# EasyEDA Pro project MecanumDrone_SchematicV1.epro

# Schematic Schematic1
Board Name: Board1; Create Date: 2026-01-27; Page Name: P1; Project Name: Mecanum_Drone_PCB; Schematic Name: Schematic1; Update Date: 2026-01-27; Company: EasyEDA.com; Page Size: A4; Version: V1.0
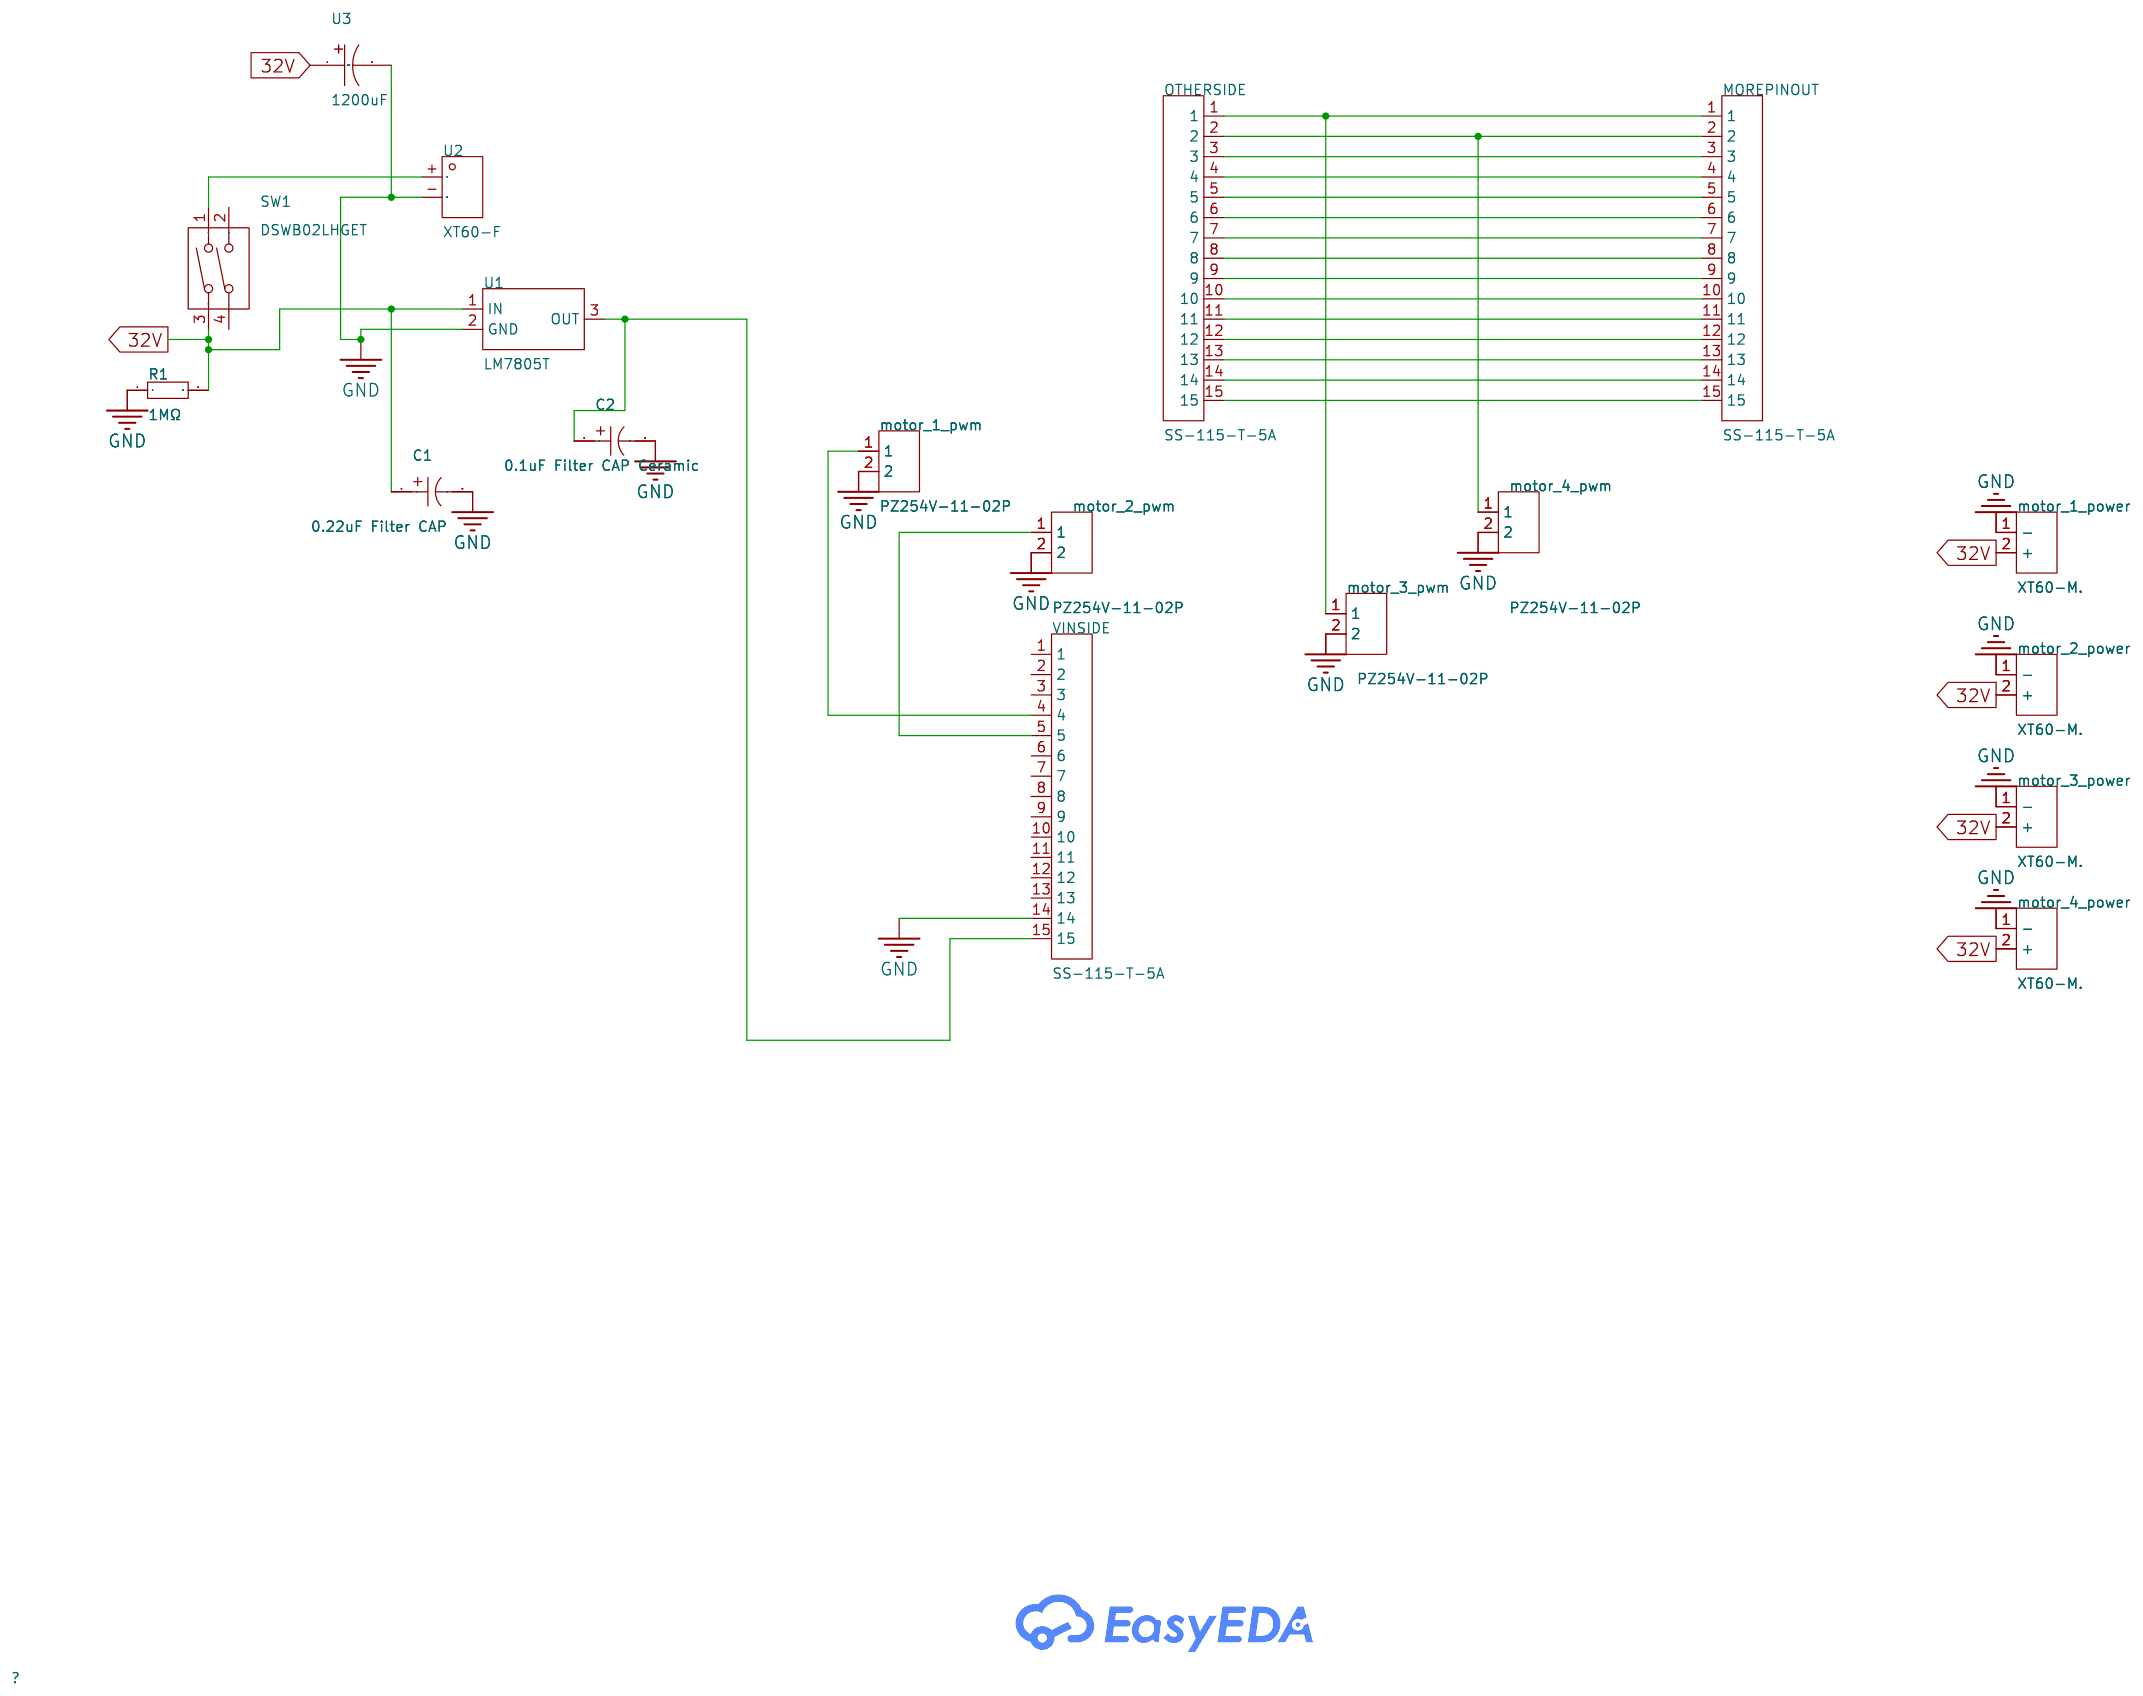
[diagram p0: schematic sheet]

## Parts
C1  0.22uF Filter CAP  [CAP-TH_BD6.0-P2.50-D0.5-FD]
C2  0.1uF Filter CAP Ceramic  [CAP-TH_BD6.0-P2.50-D0.5-FD]
MOREPINOUT  SS-115-T-5A  [HDR-TH_15P-SS-115-T-5A]
motor_1_power  XT60-M.  [CONN-TH_XT60]
motor_1_pwm  PZ254V-11-02P  [HDR-TH_2P-P2.54-V-M]
motor_2_power  XT60-M.  [CONN-TH_XT60]
motor_2_pwm  PZ254V-11-02P  [HDR-TH_2P-P2.54-V-M]
motor_3_power  XT60-M.  [CONN-TH_XT60]
motor_3_pwm  PZ254V-11-02P  [HDR-TH_2P-P2.54-V-M]
motor_4_power  XT60-M.  [CONN-TH_XT60]
motor_4_pwm  PZ254V-11-02P  [HDR-TH_2P-P2.54-V-M]
OTHERSIDE  SS-115-T-5A  [HDR-TH_15P-SS-115-T-5A]
R1  1MΩ  [RES-TH_BD2.2-L6.5-P10.50-D0.6]
SW1  DSWB02LHGET  [SW-TH_DSWB02LHGET]
U1  LM7805T  [TO-220-3_L10.0-W4.5-P2.54-L-1]
U2  XT60-F  [CONN-TH_XT60PB-F]
U3  1200uF  [CAP-TH_BD30.0-P10.00-D2.3-FD]
VINSIDE  SS-115-T-5A  [HDR-TH_15P-SS-115-T-5A]

## Library data of the parts
C1 C2 = KM1E101M0611: Capacitance:100uF Tolerance:±20% Tolerance:±20% Voltage Rating:25V Ripple Current:142mA@120kHz Equivalent Series Resistance(ESR):- Pin Spacing:2.5mm Diameter:- Height - Seated (Max):- Lifetime:2000hrs@105℃ Operating Temperature:-40℃~+105℃ Operating Temper; LCSC Part Name: 100uF ±20% 25V; Supplier Part: C2873969; Manufacturer: ROQANG(容强); Supplier Footprint: 插件; JLCPCB Part Class: Extended Part; Datasheet: https://item.szlcsc.com/datasheet/KM1E101M0611/3078452.html; Supplier: LCSC; Tolerance: ±20%; Voltage Rating: 25V; Ripple Current: 142mA@120kHz; Pin Spacing: 2.5mm; Lifetime: 2000hrs@105℃; Operating Temperature: -40℃~+105℃
MOREPINOUT OTHERSIDE VINSIDE = SS-115-T-5A: Pitch:2.54mm Mounting Type:Through Hole Number of Rows:1 Number of Positions:15P Insulation Height:2.54mm Contact Plating:Tin Operating Temperature:-55℃~+125℃ Operating Temperature:-55℃~+125℃; LCSC Part Name: 间距:2.54mm 直插; Supplier Part: C7369866; Manufacturer: SAMTEC; Supplier Footprint: 插件,P=2.54mm; JLCPCB Part Class: Extended Part; Datasheet: https://item.szlcsc.com/datasheet/SS-115-T-5A/8340830.html; Supplier: LCSC; Pitch: 2.54mm; Mounting Type: Through Hole; Number of Rows: 1; Number of Positions: 15P; Insulation Height: 2.54mm; Contact Plating: Tin; Operating Temperature: -55℃~+125℃
motor_1_power motor_2_power motor_3_power motor_4_power = XT60-M.: LCSC Part Name: AMASS(艾迈斯) XT60模型插头 3.5mm镀金香蕉头公头（电调端）XT60-M; Supplier Part: C98733; Manufacturer: AMASS(艾迈斯); JLCPCB Part Class: Extended Part; Datasheet: https://item.szlcsc.com/datasheet/XT60-M./99943.html; Supplier: LCSC
motor_1_pwm motor_2_pwm motor_3_pwm motor_4_pwm = PZ254V-11-02P: Pin Structure:1x2P Pitch:2.54mm Row Spacing:- Circluar Pins/Square Pins:Pin Header Mounting Type:Through Hole Number of Rows:1 Number of Pins:2P Current Rating:- Voltage Rating (Max):- Length of Mating Pin:6mm Insulation Height:2.5mm Length of End Connect; LCSC Part Name: 1x2P 间距:2.54mm 方针 直插; Supplier Part: C492401; Manufacturer: XFCN(兴飞); Supplier Footprint: 插件,P=2.54mm; JLCPCB Part Class: Extended Part; Datasheet: https://item.szlcsc.com/datasheet/PZ254V-11-02P/502957.html; Supplier: LCSC; Pin Structure: 1x2P; Pitch: 2.54mm; Circluar Pins/Square Pins: Pin Header; Mounting Type: Through Hole; Number of Rows: 1; Number of Pins: 2P; Length of Mating Pin: 6mm; Insulation Height: 2.5mm; Length of End Connection Pin: 3mm; Contact Material: Brass; Operating Temperature: -40℃~+105℃; Color: Black
R1 = RN1/2WS1MΩFT/BA1: Type:Metal Film Resistor Resistance:1MΩ Tolerance:±1% Tolerance:±1% Power(Watts):500mW Temperature Coefficient:±100ppm/℃ Temperature Coefficient:±100ppm/℃; LCSC Part Name: 1MΩ ±1% 500mW 金属膜电阻; Supplier Part: C385464; Manufacturer: Tyohm(幸亚电阻); Supplier Footprint: 插件,D2.4xL6.5mm; JLCPCB Part Class: Extended Part; Datasheet: https://item.szlcsc.com/datasheet/RN1%252F2WS1M%25CE%25A9FT%252FBA1/359311.html; Supplier: LCSC; Type: Metal Film Resistor; Tolerance: ±1%; Power(Watts): 500mW; Temperature Coefficient: ±100ppm/℃
SW1 = DSWB02LHGET: Type:Slide, Rocked Circuit:SPST Number of Positions:2 Lead Pitch:2.54mm Operating Life:- Color:Red; LCSC Part Name: 拨码开关,平拨开关,DSWB02LHGET; Supplier Part: C99421; Manufacturer: YE; Supplier Footprint: 插件,P=2.54mm; JLCPCB Part Class: Extended Part; Datasheet: https://item.szlcsc.com/datasheet/DSWB02LHGET/100635.html; Supplier: LCSC; Type: Slide, Rocked; Circuit: SPST; Number of Positions: 2; Lead Pitch: 2.54mm; Color: Red
U1 = LM7805T_C36350857: Output Type:Fixed Voltage - Supply:35V Output Voltage:5V Output Voltage:5V Output Current:1.5A Power Supply Rejection Ratio (PSRR):- Voltage Dropout:2V@(1.0A) Noise:- Operating Temperature:-40℃~+125℃ Operating Temperature:-40℃~+125℃ Output Configuration:P; LCSC Part Name: 5V 1.5A 35V; Supplier Part: C36350857; Manufacturer: HTC; Supplier Footprint: TO-220-3L; JLCPCB Part Class: Extended Part; Datasheet: https://item.szlcsc.com/datasheet/LM7805T/38073495.html; Supplier: LCSC; Output Type: Fixed; Voltage - Supply: 35V; Output Voltage: 5V; Output Current: 1.5A; Voltage Dropout: 2V@(1.0A); Operating Temperature: -40℃~+125℃; Output Configuration: Positive; Number of Outputs: 1
U2 = XT60-F: LCSC Part Name: AMASS(艾迈斯)XT60模型插头 3.5mm镀金香蕉头母头 XT60-F; Supplier Part: C98734; Manufacturer: AMASS(艾迈斯); JLCPCB Part Class: Extended Part; Datasheet: https://item.szlcsc.com/datasheet/XT60-F/99944.html; Supplier: LCSC
U3 = B43305B2128M67: Capacitance: Tolerance:±20% Tolerance:±20% Rated Voltage:; LCSC Part Name: 1200uF ±20% 200V; Supplier Part: C1647575; Manufacturer: TDK; Supplier Footprint: 插件; JLCPCB Part Class: Extended Part; Datasheet: https://atta.szlcsc.com/upload/public/pdf/source/20210702/9B2BA3B8BD2BC0A8ED472DCAE1779BDC.pdf; Supplier: LCSC; Tolerance: ±20%

## Nets
32V: C1.1 motor_1_power.2(+) motor_2_power.2(+) motor_3_power.2(+) motor_4_power.2(+) R1.2 SW1.3 U1.1(IN) U3.1
GND: C1.2 C2.2 motor_1_power.1(-) motor_1_pwm.2 motor_2_power.1(-) motor_2_pwm.2 motor_3_power.1(-) motor_3_pwm.2 motor_4_power.1(-) motor_4_pwm.2 R1.1 U1.2(GND) U2.-(2) U3.2 VINSIDE.14
Net-(C2-1): C2.1 U1.3(OUT) VINSIDE.15
Net-(MOREPINOUT-1): MOREPINOUT.1 motor_3_pwm.1 OTHERSIDE.1
Net-(MOREPINOUT-2): MOREPINOUT.2 motor_4_pwm.1 OTHERSIDE.2
Net-(MOREPINOUT-3): MOREPINOUT.3 OTHERSIDE.3
Net-(MOREPINOUT-4): MOREPINOUT.4 OTHERSIDE.4
Net-(MOREPINOUT-5): MOREPINOUT.5 OTHERSIDE.5
Net-(MOREPINOUT-6): MOREPINOUT.6 OTHERSIDE.6
Net-(MOREPINOUT-7): MOREPINOUT.7 OTHERSIDE.7
Net-(MOREPINOUT-8): MOREPINOUT.8 OTHERSIDE.8
Net-(MOREPINOUT-9): MOREPINOUT.9 OTHERSIDE.9
Net-(MOREPINOUT-10): MOREPINOUT.10 OTHERSIDE.10
Net-(MOREPINOUT-11): MOREPINOUT.11 OTHERSIDE.11
Net-(MOREPINOUT-12): MOREPINOUT.12 OTHERSIDE.12
Net-(MOREPINOUT-13): MOREPINOUT.13 OTHERSIDE.13
Net-(MOREPINOUT-14): MOREPINOUT.14 OTHERSIDE.14
Net-(MOREPINOUT-15): MOREPINOUT.15 OTHERSIDE.15
Net-(motor_1_pwm-1): motor_1_pwm.1 VINSIDE.4
Net-(motor_2_pwm-1): motor_2_pwm.1 VINSIDE.5
Net-(SW1-1): SW1.1 U2.+(1)

Not connected (* = marked no-connect by the designer): SW1 2 4; VINSIDE 1 2 3 6 7 8 9 10 11 12 13
